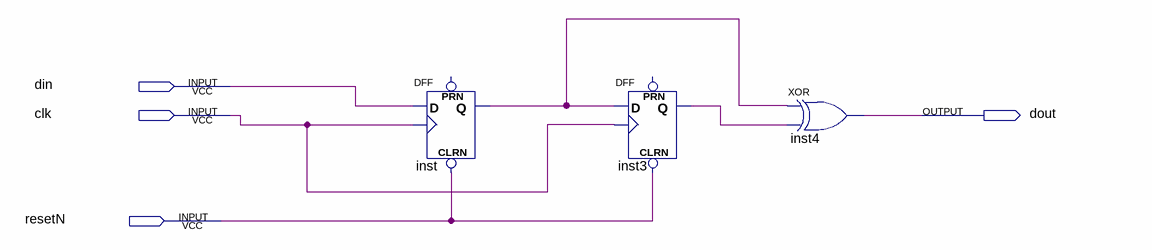
[diagram p0: schematic sheet]
// Quartus schematic gozer_du.bdf as structural Verilog: 3 symbols, 4 pins
module gozer_du (
  input  din,
  input  clk,
  input  resetN,
  output dout
);

  wire inst3_q, inst_q;

  DFF inst (.CLRN(resetN), .CLK(clk), .D(din), .Q(inst_q));  // open: PRN
  DFF inst3 (.CLRN(resetN), .CLK(clk), .D(inst_q), .Q(inst3_q));  // open: PRN
  xor inst4 (dout, inst_q, inst3_q);
endmodule
